# EAGLE design I2CLCD (EAGLE 7.1.0)
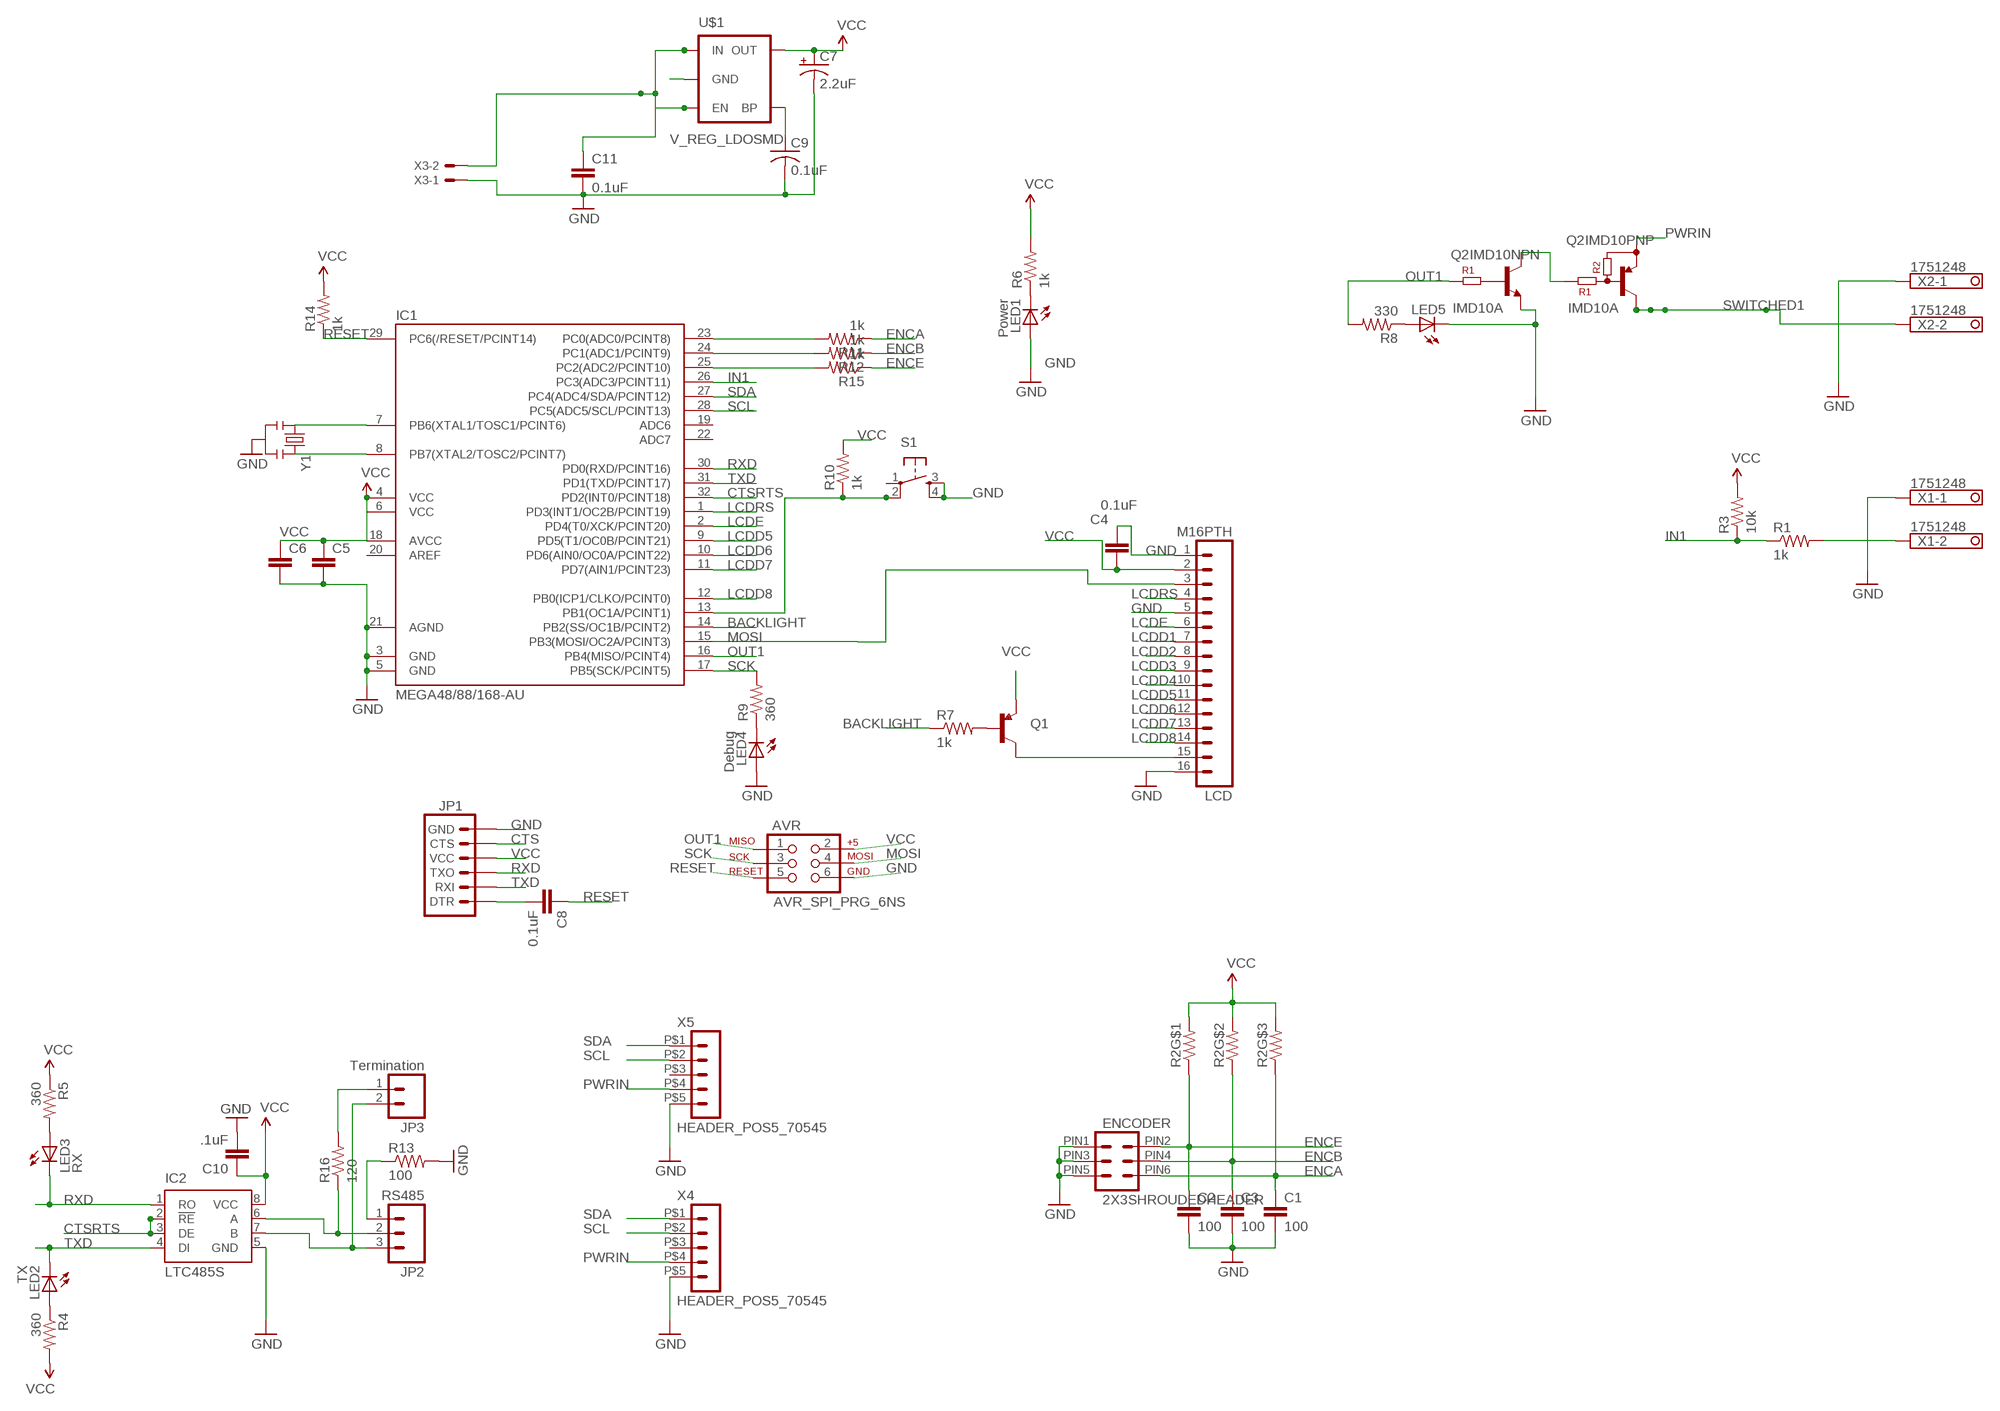
[diagram p0: schematic, sheet 1]

## Parts
AVR  AVR_SPI_PRG_6NS  [2X3-NS]
C1  100  CAP0603-CAP  [0603-CAP]
C2  100  CAP0603-CAP  [0603-CAP]
C3  100  CAP0603-CAP  [0603-CAP]
C4  0.1uF  CAP0603-CAP  [0603-CAP]
C5  CAP0603-CAP  [0603-CAP]
C6  CAP0603-CAP  [0603-CAP]
C7  2.2uF  CAP_POL1206  [EIA3216]
C8  0.1uF  CAP0603-CAP  [0603-CAP]
C9  0.1uF  C-USC0603  [C0603]
C10  .1uF  CAP0603-CAP  [0603-CAP]
C11  0.1uF  CAP0603-CAP  [0603-CAP]
ENCODER  2X3SHROUDEDHEADER  [2X3SHROUDEDHEADER]
IC1  MEGA48/88/168-AU  [TQFP32-08]
IC2  LTC485S  [SOIC8]
JP1  ARDUINO_SERIAL_PROGRAMPTH  [1X06]
JP2  RS485  M03SCREW_LOCK  [SCREWTERMINAL-3.5MM-3_LOCK.007S]
JP3  Termination  M02LOCK  [1X02_LOCK]
LCD  M16PTH  [1X16]
LED1  Power  LED0603  [LED-0603]
LED2  TX  LED0603  [LED-0603]
LED3  RX  LED0603  [LED-0603]
LED4  Debug  LED0603  [LED-0603]
LED5  LED0603  [LED-0603]
Q1  PNP  TRANSISTOR_PNPSMD  [SOT23-3]
Q2  IMD10A  [SC-74]
R1  1k  RESISTOR0603-RES  [0603-RES]
R2  RESISTOR_4PACK_US  [RESPACK_4X0603]
R3  10k  RESISTOR0603-RES  [0603-RES]
R4  360  R-US_R0603  [R0603]
R5  360  R-US_R0603  [R0603]
R6  1k  R-US_R0603  [R0603]
R7  1k  RESISTOR0603-RES  [0603-RES]
R8  330  RESISTOR0603-RES  [0603-RES]
R9  360  R-US_R0603  [R0603]
R10  1k  R-US_R0603  [R0603]
R11  1k  R-US_R0603  [R0603]
R12  1k  R-US_R0603  [R0603]
R13  100  RESISTOR  [0805]
R14  1k  R-US_R0603  [R0603]
R15  1k  R-US_R0603  [R0603]
R16  120  RESISTOR0603-RES  [0603-RES]
S1  TAC_SWITCHSMD  [TACTILE_SWITCH_SMD]
U$1  V_REG_LDOSMD  [SOT23-5]
X1  1751248  [1751248]
X2  1751248  [1751248]
X3  22-23-2021  [22-23-2021]
X4  HEADER_POS5_70545  [70545-POS5]
X5  HEADER_POS5_70545  [70545-POS5]
Y1  16Mhz  RESONATORSMD  [RESONATOR-SMD]

## Nets
A: IC2.6(A) JP2.2 R16.1
B: IC2.7(B) JP2.3 JP3.2
BACKLIGHT: IC1.14(PB2(SS/OC1B/PCINT2)) R7.1
CTS: JP1.5(CTS)
CTSRTS: IC1.32(PD2(INT0/PCINT18)) IC2.2(!RE) IC2.3(DE)
ENCA: C1.1 ENCODER.PIN6 R2.3 R11.1
ENCAF: IC1.23(PC0(ADC0/PCINT8)) R11.2
ENCB: C3.1 ENCODER.PIN4 R2.2 R12.1
ENCBF: IC1.24(PC1(ADC1/PCINT9)) R12.2
ENCE: C2.1 ENCODER.PIN2 R2.1 R15.1
ENCEF: IC1.25(PC2(ADC2/PCINT10)) R15.2
GND: AVR.6 C1.2 C2.2 C3.2 C4.2 C5.2 C6.2 C7.C(-) C9.2 C10.2 C11.2 ENCODER.PIN1 ENCODER.PIN3 ENCODER.PIN5 IC1.3(GND) IC1.5(GND) IC1.21(AGND) IC2.5(GND) JP1.6(GND) LCD.1 LCD.5 LCD.16 LED1.A LED4.A LED5.C Q2.3(IMD10NPN:E) R13.2 S1.3 S1.4 U$1.2(GND) X1.1 X2.1 X3.1 X4.P$5 X5.P$5 Y1.2
IN1: IC1.26(PC3(ADC3/PCINT11)) R1.1 R3.1
LCDD1: LCD.7
LCDD2: LCD.8
LCDD3: LCD.9
LCDD4: LCD.10
LCDD5: IC1.9(PD5(T1/OC0B/PCINT21)) LCD.11
LCDD6: IC1.10(PD6(AIN0/OC0A/PCINT22)) LCD.12
LCDD7: IC1.11(PD7(AIN1/PCINT23)) LCD.13
LCDD8: IC1.12(PB0(ICP1/CLKO/PCINT0)) LCD.14
LCDE: IC1.2(PD4(T0/XCK/PCINT20)) LCD.6
LCDRS: IC1.1(PD3(INT1/OC2B/PCINT19)) LCD.4
MOSI: AVR.4 IC1.15(PB3(MOSI/OC2A/PCINT3)) LCD.3
N$1: LCD.15 Q1.3(C)
N$3: IC1.8(PB7(XTAL2/TOSC2/PCINT7)) Y1.3
N$4: IC1.7(PB6(XTAL1/TOSC1/PCINT6)) Y1.1
N$5: C8.2 JP1.1(DTR)
N$6: R1.2 X1.2
N$7: IC1.13(PB1(OC1A/PCINT1)) R10.1 S1.2
N$8: LED4.C R9.1
N$10: JP3.1 R16.2
N$22: LED2.A R4.1
N$23: LED1.C R6.1
N$28: C9.1 U$1.4(BP)
N$36: Q1.1(B) R7.2
N$44: LED5.A R8.1
N$52: Q2.4(IMD10NPN:C) Q2.5(IMD10PNP:B)
N$91: JP2.1 R13.1
N$92: LED3.A R5.2
OUT1: AVR.1 IC1.16(PB4(MISO/PCINT4)) Q2.2(IMD10NPN:B) R8.2
PWRIN: C11.1 Q2.6(IMD10PNP:E) U$1.1(IN) U$1.3(EN) X3.2 X4.P$4 X5.P$4
RESET: AVR.5 C8.1 IC1.29(PC6(/RESET/PCINT14)) R14.1
RXD: IC1.30(PD0(RXD/PCINT16)) IC2.1(RO) JP1.3(TXO) LED3.C
SCK: AVR.3 IC1.17(PB5(SCK/PCINT5)) R9.2
SCL: IC1.28(PC5(ADC5/SCL/PCINT13)) X4.P$2 X5.P$2
SDA: IC1.27(PC4(ADC4/SDA/PCINT12)) X4.P$1 X5.P$1
SWITCHED1: Q2.1(IMD10PNP:C) X2.2
TXD: IC1.31(PD1(TXD/PCINT17)) IC2.4(DI) JP1.2(RXI) LED2.C
VCC: AVR.2 C4.1 C5.1 C6.1 C7.A(+) C10.1 IC1.4(VCC) IC1.18(AVCC) IC2.8(VCC) JP1.4(VCC) LCD.2 Q1.2(E) R2.6 R2.7 R2.8 R3.2 R4.2 R5.1 R6.2 R10.2 R14.2 U$1.5(OUT)
Unconnected: IC1.19(ADC6) IC1.20(AREF) IC1.22(ADC7) R2.4 R2.5 S1.1 X4.P$3 X5.P$3

## Power pins joined to a net without a drawn wire
VCC: IC1.6(VCC)

## Library data of the parts
AVR = SparkFun:AVR_SPI_PRG_6: AVR ISP 6 Pin This is the reduced ISP connector for AVR programming. Common on Arduino. This footprint will take up less PCB space and can be used with a 10-pin to 6-pin adapter such as SKU: BOB-08508
C1-C6 C8 C10 C11 = SparkFun:CAP: Capacitor Standard 0603 ceramic capacitor, and 0.1" leaded capacitor.
C7 = SparkFun:CAP_POL: Capacitor Polarized These are standard SMD and PTH capacitors. Normally 10uF, 47uF, and 100uF in electrolytic and tantalum varieties. Always verify the external diameter of the through hole cap, it varies with capacity, voltage, and manufacturer. The EIA devices should be standard.
C9 = rcl:C-US: CAPACITOR, American symbol
ENCODER = personal:2X3SHROUDEDHEADER
IC1 = avr-5:MEGA48/88/168
IC2 = linear-technology:LTC485: Low Power RS485 Interface Transceiver Source: http://www.linear.com/pc/downloadDocument.do?navId=H0,C1,C1007,C1017,P2064,D1718
JP1 = SparkFun:ARDUINO_SERIAL_PROGRAM
JP2 = SparkFun:M03: Header 3 Standard 3-pin 0.1" header. Use with straight break away headers (SKU : PRT-00116), right angle break away headers (PRT-00553), swiss pins (PRT-00743), machine pins (PRT-00117), and female headers (PRT-00115). Molex polarized connector foot print use with SKU : PRT-08232 with associated crimp pins and housings.
JP3 = SparkFun:M02: Header 2 Standard 2-pin 0.1" header. Use with straight break away headers (SKU : PRT-00116), right angle break away headers (PRT-00553), swiss pins (PRT-00743), machine pins (PRT-00117), and female headers (PRT-00115). Molex polarized connector foot print use with SKU : PRT-08233 with associated crimp pins and housings.
LCD = SparkFun:M16
LED1-LED5 = SparkFun:LED: LEDs Standard schematic elements and footprints for 5mm, 3mm, 1206, and 0603 sized LEDs. 5mm - Spark Fun Electronics SKU : COM-00529 (and others)
Q1 = SparkFun:TRANSISTOR_PNP
Q2 = personal:IMD10A
R1 R3 R7 R8 R13 R16 = SparkFun:RESISTOR: Resistor Basic schematic elements and footprints for 0603, 1206, and PTH 1/10th watt (small) resistors.
R2 = microbuilder:RESISTOR_4PACK_US: Resistor Packs (4 resistors) 4 x 0603 10K 1/16W - Digikey: YC164J-10KCT-ND
R4-R6 R9-R12 R14 R15 = rcl:R-US_: RESISTOR, American symbol
S1 = SparkFun:TAC_SWITCH: Momentary Switch Button commonly used for reset or general input. Spark Fun Electronics SKU : COM-00097
U$1 = SparkFun:V_REG_LDO: Voltage Regulator LDO Standard 150mA LDO voltage regulator in SOT-23 layout. Micrel part MIC5205. BP (by-pass) pin is used to lower output noise with 470pF cap.
X1 X2 = con-phoenix-350:1751248: MKDS 1/ 2-3,5 Printklemme Nennstrom: 10 A Bemessungsspannung: 160 V Raster: 3,5 mm Polzahl: 2 Montageart: Löten Anschlussart: Schraubanschluss Anschlussrichtung vom Leiter zur Platine: 0° Source: http://eshop.phoenixcontact.com .. 1751248.pdf
X3 = con-molex:22-23-2021: .100" (2.54mm) Center Header - 2 Pin
X4 X5 = con-molex-c-grid-sl:HEADER_POS5_?: Molex -C-Grid® / SL Series connector Wire-to-Board 2.54 mm (0.100") pitch header, 5 positions.
Y1 = SparkFun:RESONATOR: Resonator Small SMD resonator. This is the itty bitty 10/20MHz resonators with built in caps. CSTCE10M0G55 and CSTCE20M0V53. Footprint has been reviewed closely but hasn't been tested yet.

## Net classes
1 PWR: width 0.508 mm

## Board
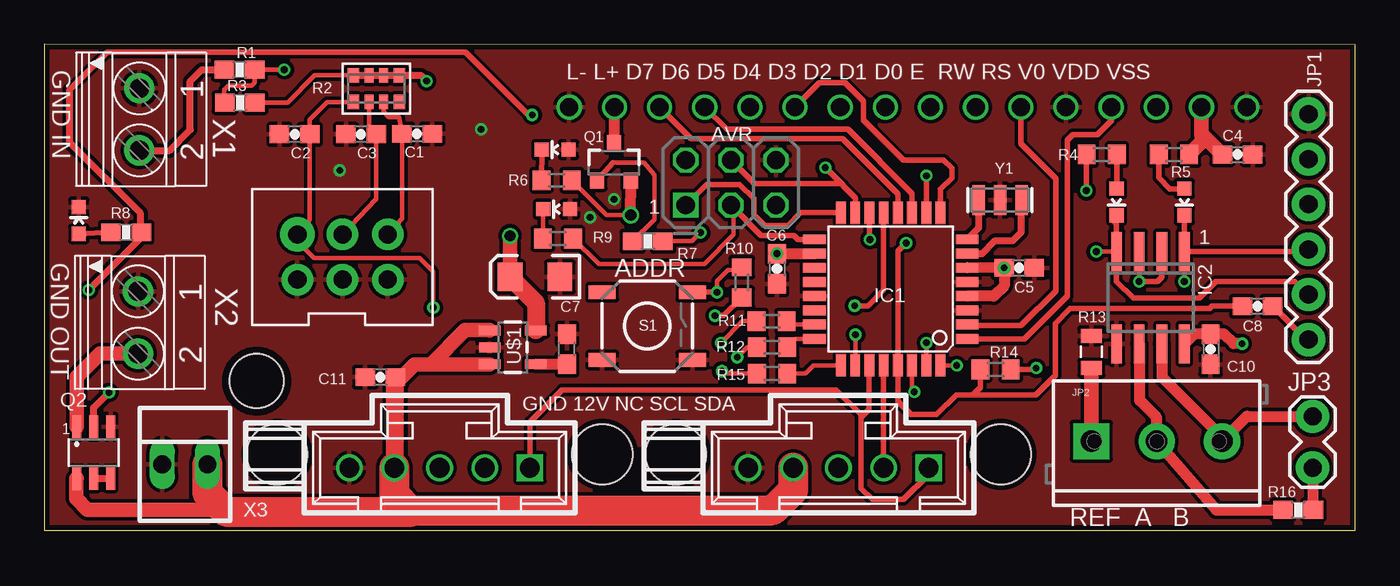
[diagram p1: board, top side]
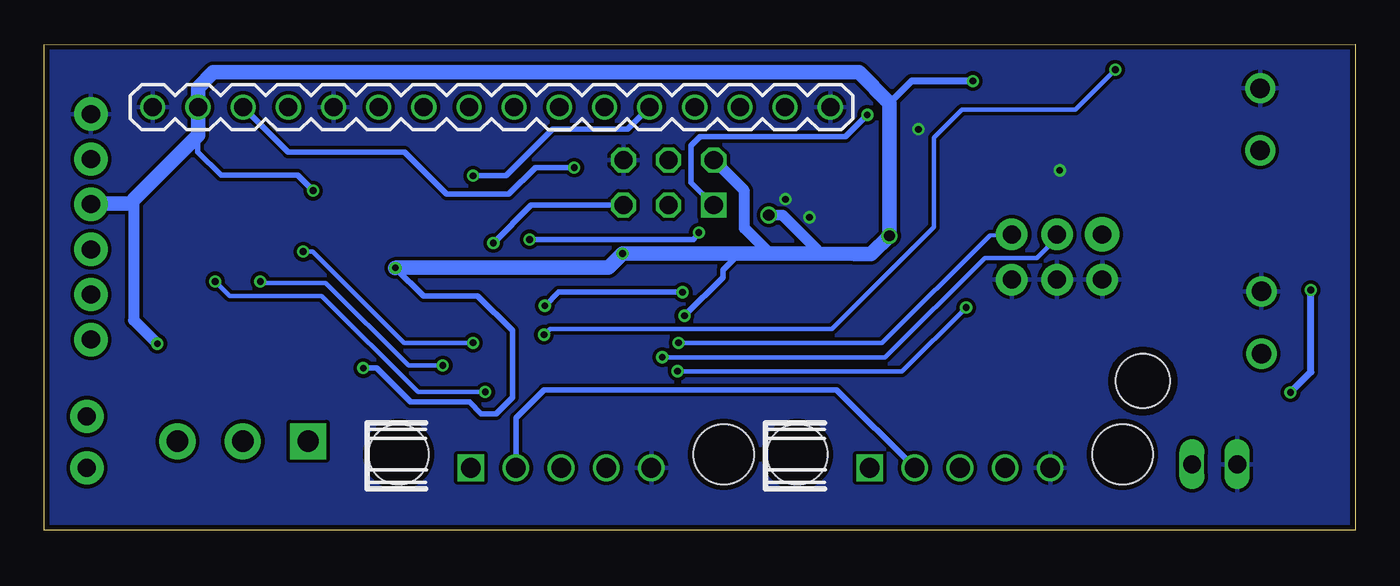
[diagram p2: board, bottom side, seen from below]

Size 73.71 x 27.33 mm. Coordinates in mm from the lower left corner, seen from the top.
Outline: 0,0 73.71,0 73.71,27.3 0,27.33 0,0
Copper layers (1*16): Top 0.035mm / dielectric 1.5mm / Bottom 0.035mm
Design rules "default *": minimum track width 8mil, minimum drill 15mil, track to track 8mil, track to pad 8mil, pad to pad 8mil, via to via 8mil, smd to smd 8mil, copper to edge 0.3mm, drill to drill 0.2mm, minimum pad ring 0.2mm, minimum via ring 0.15mm, stop-mask expansion 0.075mm, vias tented up to drill 15mil, thermal gap 0.2mm

### Footprints (pad centres in the part's own frame; a part is rotated, then mirrored left to right if it is on the bottom)
2X3-NS = drill 1.016 square: 1 -2.54,-1.27 | drill 1.016 octagon: 2 -2.54,1.27; 3 0,-1.27; 4 0,1.27; 5 2.54,-1.27; 6 2.54,1.27
0603-CAP = smd 1.1 x 1: 1 -0.85,0; 2 0.85,0
EIA3216 = smd 1.4 x 1.6: A 1.4,0; C -1.4,0
C0603 = smd 1.1 x 1: 1 -0.85,0; 2 0.85,0
2X3SHROUDEDHEADER = drill 1.02 pad 1.778: PIN1 0,2.54; PIN3 2.54,2.54; PIN4 2.54,5.08; PIN5 5.08,2.54; PIN6 5.08,5.08 | drill 1.02 pad 1.93: PIN2 0,5.08
TQFP32-08 = smd 1.27 x 0.559: 1 -4.293,2.8; 2 -4.293,2; 3 -4.293,1.2; 4 -4.293,0.4; 5 -4.293,-0.4; 6 -4.293,-1.2; 7 -4.293,-2; 8 -4.293,-2.8; 17 4.293,-2.8; 18 4.293,-2; 19 4.293,-1.2; 20 4.293,-0.4; 21 4.293,0.4; 22 4.293,1.2; 23 4.293,2; 24 4.293,2.8 | smd 0.559 x 1.27: 9 -2.8,-4.293; 10 -2,-4.293; 11 -1.2,-4.293; 12 -0.4,-4.293; 13 0.4,-4.293; 14 1.2,-4.293; 15 2,-4.293; 16 2.8,-4.293; 25 2.8,4.293; 26 2,4.293; 27 1.2,4.293; 28 0.4,4.293; 29 -0.4,4.293; 30 -1.2,4.293; 31 -2,4.293; 32 -2.8,4.293
SOIC8 = smd 0.6 x 2.2: 1 -1.905,-2.6; 2 -0.635,-2.6; 3 0.635,-2.6; 4 1.905,-2.6; 5 1.905,2.6; 6 0.635,2.6; 7 -0.635,2.6; 8 -1.905,2.6
1X06 = drill 1.016 pad 1.88: 1 0,0; 2 2.54,0; 3 5.08,0; 4 7.62,0; 5 10.16,0; 6 12.7,0
SCREWTERMINAL-3.5MM-3_LOCK.007S = drill 1.2 pad 2.032 square: 1 -0.178,0 | drill 1.2 pad 2.032: 2 3.5,0; 3 7.178,0
1X02_LOCK = drill 1.016 pad 1.88: 1 -0.178,0; 2 2.718,0
1X16 = drill 1.016: 1 0,0; 2 2.54,0; 3 5.08,0; 4 7.62,0; 5 10.16,0; 6 12.7,0; 7 15.24,0; 8 17.78,0; 9 20.32,0; 10 22.86,0; 11 25.4,0; 12 27.94,0; 13 30.48,0; 14 33.02,0; 15 35.56,0; 16 38.1,0
LED-0603 = smd 0.8 x 0.8: A 0,-0.75; C 0,0.75
SOT23-3 = smd 0.8 x 0.9: 1 -0.95,-1; 2 0.95,-1; 3 0,1.1
SC-74 = smd 0.5 x 1.3: 1 -0.95,1.45; 2 0,1.45; 3 0.95,1.45; 4 0.95,-1.45; 5 0,-1.45; 6 -0.95,-1.45
0603-RES = smd 1.1 x 1: 1 -0.85,0; 2 0.85,0
RESPACK_4X0603 = smd 0.65 x 0.8: 1 -1.3,-0.75; 4 1.3,-0.75; 5 1.3,0.75; 8 -1.3,0.75 | smd 0.5 x 0.8: 2 -0.4,-0.75; 3 0.4,-0.75; 6 0.4,0.75; 7 -0.4,0.75
R0603 = smd 1 x 1.1: 1 -0.85,0; 2 0.85,0
0805 = smd 0.8 x 1.2: 1 -0.9,0; 2 0.9,0
TACTILE_SWITCH_SMD = smd 1.524 x 0.762: 1 -2.54,1.905; 2 2.54,1.905; 3 -2.54,-1.905; 4 2.54,-1.905
SOT23-5 = smd 0.55 x 1.2: 1 -0.95,-1.3; 2 0,-1.3; 3 0.95,-1.3; 4 0.95,1.3; 5 -0.95,1.3
STAND-OFF-TIGHT = hole 3.048: 0,0
1751248 = drill 1.1 pad 1.7: 1 -1.75,-0.1; 2 1.75,-0.1
22-23-2021 = drill 1 long: 1 -1.27,0; 2 1.27,0
70545-POS5 = drill 1.1 square: P$1 5.08,0 | drill 1.1: P$2 2.54,0; P$3 0,0; P$4 -2.54,0; P$5 -5.08,0 | hole 3.404: -9.144,0.762; 9.144,0.762
RESONATOR-SMD = smd 0.7 x 1.7: 1 -1.2,0; 2 0,0; 3 1.2,0

### Placement (x,y rotation side)
AVR  38.61,19.56 0 top
C1  20.95,22.3 0 top
C2  14.07,22.28 180 top
C3  17.81,22.28 180 top
C4  67.11,21.13 0 top
C5  54.81,14.76 0 top
C6  41.2,14.71 270 top
C7  27.58,14.25 180 top
C8  68.22,12.6 0 top
C9  29.39,10.19 90 top
C10  65.58,10.19 270 top
C11  18.9,8.61 180 top
ENCODER  14.22,11.56 0 top
IC1  47.6,13.56 180 top
IC2  62.2,13.08 180 top
JP1  71.09,10.72 90 top
JP2  59.05,5 0 top
JP3  71.32,3.68 90 top
LCD  67.61,23.8 0 bottom
LED1  28.73,21.41 90 top
LED2  60.3,18.47 180 top
LED3  64.11,18.47 180 top
LED4  28.8,18.06 90 top
LED5  1.93,17.42 0 top
Q1  32.03,20.68 0 top
Q2  2.77,4.37 0 top
R1  10.97,25.91 180 top
R2  18.67,24.84 0 top
R3  11,24.05 0 top
R4  59.46,21.13 180 top
R5  63.53,21.13 180 top
R6  28.8,19.69 0 top
R7  33.93,16.26 180 top
R8  4.6,16.76 0 top
R9  28.88,16.41 0 top
R10  39.22,13.94 270 top
R11  40.89,11.76 0 top
R12  40.92,10.29 0 top
R13  58.88,10.03 90 top
R14  53.49,9.04 0 top
R15  40.92,8.81 0 top
R16  70.51,1.14 0 top
S1  33.91,11.48 0 top
U$1  26.34,10.29 270 top
U$2  [STAND-OFF-TIGHT]  11.94,8.38 0 top
X1  5.44,23.11 270 top
X2  5.36,11.68 270 top
X3  7.9,3.71 0 top
X4  22.22,3.51 0 top
X5  44.65,3.51 0 top
Y1  53.75,18.57 180 top

### Tracks (layer width: path | path; a pad name or v marks a point on that pad's centre or on a via)
A
  Top 0.61: IC2.6 61.59,10.46 61.59,7.29 62.55,6.33 JP2.2 65.91,1.14 R16.1
B
  Top 0.61: IC2.7 62.86,10.46 62.86,8.59 66.23,5.22 JP2.3 67.63,6.4 JP3.2
BACKLIGHT  (via drill 0.38)
  Top 0.254: v36.91,16.74 36.42,16.26 R7.1
  Top 0.305: IC1.14 46.4,16.39 v46.43,16.36
  Bottom 0.305: v46.43,16.36 37.21,16.36 v36.91,16.74
CTSRTS  (via drill 0.38)
  Top 0.254: IC1.32 v51.31,9.27 | v61.57,14 IC2.3
  Top 0.305: IC2.2 62.84,14.25 62.59,14 v61.57,14
  Bottom 0.254: v51.31,9.27 53.24,9.27 57.89,13.92 61.49,13.92 v61.57,14
ENCA  (via drill 0.38)
  Top 0.254: R2.3 19.07,23.55 19.35,23.24 19.95,23.24 C1.1 20.1,17.54 ENCODER.PIN6 | v38.05,10.54 39.27,11.76 R11.1
  Bottom 0.254: 37.95,10.52 v38.05,10.54 26.75,10.52 26.62,10.52 20.55,16.59 ENCODER.PIN6
ENCAF
  Top 0.254: R11.2 41.94,11.56 IC1.23
ENCB  (via drill 0.38)
  Top 0.254: R2.2 18.27,22.66 C3.1 18.66,18.6 18.63,18.6 ENCODER.PIN4 | v38.96,9.73 39.52,10.29 R12.1
  Bottom 0.254: v38.96,9.73 27.31,9.71 26.44,9.71 20.83,15.32 17.91,15.32 16.64,16.59 ENCODER.PIN4
ENCBF
  Top 0.254: R12.2 42.25,10.76 IC1.24
ENCE  (via drill 0.38)
  Top 0.254: R2.1 15.9,24.08 14.92,23.1 C2.1 14.92,17.44 ENCODER.PIN2 14.07,16.41 15.16,15.32 21.11,15.32 21.87,14.55 v21.87,12.52 | v38.1,8.94 38.23,8.81 R15.1
  Bottom 0.254: v38.1,8.94 26.9,8.92 25.47,8.92 v21.87,12.52
ENCEF
  Top 0.254: R15.2 42.8,8.81 43.26,9.27 IC1.25
GND  (via drill 0.38)
  other vias: 16.61,20.24 24.56,22.56 30.68,17.6 32.03,18.62
  pour Bottom: 73.38,27.23 -0.2,27.2 0.13,-0.23 73.51,0.05
  pour Top: 0.05,-0.15 73.56,-0.03 73.36,27.23 17.12,27.28 -0.1,27.1
IN1  (via drill 0.38)
  Top 0.254: IC1.26 45.62,9.29 v45.62,11 | v13.49,25.91 R1.1 11.82,25.18 11.66,25.02 10.34,25.02 10.11,24.79 10.11,24.17 R3.1
  Bottom 0.254: v45.62,11 45.29,11.33 29.41,11.33 23.7,17.04 23.7,22.07 22.1,23.67 15.72,23.67 v13.49,25.91
LCDD5
  Top 0.305: LCD.11 43.59,25.17 45.03,25.17 46.08,24.13 46.08,23.06 48.31,20.83 50.57,20.83 51.03,20.37 51.03,19.81 50.4,19.18 IC1.9
LCDD6  (via drill 0.38)
  Top 0.305: v49.61,19.94 v49.6,19.93 IC1.10
  Bottom 0.305: LCD.12 40.92,22.56 45.14,22.56 47.75,19.94 v49.61,19.94
LCDD7
  Top 0.305: LCD.13 38.38,22.56 45.19,22.56 48.8,18.94 IC1.11
LCDD8
  Top 0.305: LCD.14 36.37,22.02 44.88,22.02 48,18.9 IC1.12
LCDE
  Top 0.305: IC1.2 51.95,11.51 54.91,11.51 56.87,13.46 56.87,19.79 54.91,21.74 LCD.6
LCDRS
  Top 0.305: IC1.1 55.12,10.77 57.53,13.18 57.53,21.95 57.84,22.25 59.21,22.25 59.99,23.04 LCD.4
MOSI  (via drill 0.38)
  Top 0.305: AVR.4 39.93,19.51 44.78,19.51 44.91,19.38 | 44.91,19.38 45.6,18.69 IC1.15 | v43.92,20.4 44.91,19.41 44.91,19.38
  Bottom 0.305: LCD.3 59.99,21.26 53.47,21.26 51.1,18.9 47.6,18.9 46.1,20.4 v43.92,20.4
N$1
  Top 0.61: Q1.3 32.05,21.65 LCD.15
N$3
  Top 0.406: Y1.3 52.55,17.02 IC1.8
N$4
  Top 0.406: Y1.1 54.94,16.76 54.46,16.28 53.47,16.28 52.75,15.56 IC1.7
N$5
  Top 0.305: C8.2 70.95,10.72 JP1.1
N$6
  Top 0.406: R1.2 8.84,25.91 8.2,25.27 8.2,22.53 7.04,21.36 X1.2
N$7  (via drill 0.38)
  Top 0.254: R10.1 39,14.63 38.43,14.63 37.82,14.02 v37.82,13.39
  Top 0.305: IC1.13 47.19,13.51 46.3,12.62 v45.57,12.62 | S1.2 v37.82,13.39
  Bottom 0.305: v45.57,12.62 44.81,13.39 v37.82,13.39
N$8
  Top 0.254: LED4.C R9.1
N$10
  Top 0.61: JP3.1 71.36,2.83 R16.2
N$22
  Top 0.305: R4.1 LED2.A
N$23
  Top 0.305: R6.1 LED1.C
N$28
  Top 0.61: U$1.4 27.71,9.34 C9.1
N$36
  Top 0.254: R7.2 34.32,17.49 34.32,19.99 33.73,20.68 31.98,20.68
  Top 0.305: 31.98,20.68 Q1.1
N$44
  Top 0.305: R8.1 3.74,16.78 LED5.A
N$52
  Top 0.406: Q2.5 Q2.4
N$91
  Top 0.813: JP2.1 R13.1
N$92
  Top 0.305: R5.2 62.68,19.82 63.3,19.2 64.1,19.2 LED3.A
OUT1  (via drill 0.38)
  Top 0.305: AVR.1 37.24,19.46 39.09,19.46 39.9,18.64 39.9,17.73 40.49,17.14 41.81,17.14 42.52,17.86 IC1.16 | 1.42,24.79 3.53,26.9 23.67,26.9 27.2,23.37 v27.43,23.37
  Top 0.406: v2.49,13.51 5.45,16.47 R8.2 5.41,16.8 5.41,17.83 1.42,21.82 1.42,24.79 | Q2.2 2.77,6.88 v3.63,7.75
  Bottom 0.305: AVR.1 37.34,19.56 37.34,21.64 36.83,22.15 28.65,22.15 v27.43,23.37
  Bottom 0.406: v3.63,7.75 2.49,8.89 v2.49,13.51
PWRIN
  Top 0.254: C11.1 19.71,8.57 19.71,7.77
  Top 0.61: U$1.1 24.59,11.24 | 10.29,1.04 10.03,1.3
  Top 0.813: 19.71,8.23 20.82,9.34 21.73,9.34 | 21.73,9.34 U$1.3 | U$1.1 25.02,11.25 23.65,11.25 21.73,9.34 | 10.1,1.16 2.4,1.16 1.78,1.78 1.78,2.88 Q2.6
  Top 1.016: X4.P$4 19.71,3.53 19.71,7.77 19.71,8.23
  Top 1.676: X4.P$4 19.68,1.98 20.55,1.12 20.73,1.12 | 20.73,1.12 40.97,1.12 42.11,2.26 X5.P$4 | X3.2 9.17,2.08 10.1,1.16 10.21,1.04 10.29,1.04 20.65,1.04 20.73,1.12
RESET  (via drill 0.38)
  Top 0.305: v48.46,16.15 48,15.69 IC1.29 48,7.25 48.74,6.5 50.16,6.5 51.28,7.62 52.22,7.62 | 52.81,8.88 R14.1 52.64,8.04 52.22,7.62 | C8.1 65.66,12.6 65.53,12.47 57.68,12.47 56.85,11.63 56.85,8.71 55.75,7.62 52.22,7.62
  Bottom 0.305: AVR.5 46.33,18.29 v48.46,16.15
RXD  (via drill 0.38)
  Top 0.254: IC1.30 48.8,7.89 v48.92,7.77 | v64.11,14 IC2.1
  Top 0.305: JP1.3 71.15,15.68 IC2.1 LED3.C
  Bottom 0.254: v48.92,7.77 52.7,7.77 58.12,13.18 63.3,13.18 v64.11,14
SCK
  Top 0.254: AVR.3 38.76,18.14 38.76,16.64 37.11,14.99 31.2,14.99 R9.2
  Top 0.305: AVR.3 40.31,16.59 42.16,16.59 42.39,16.36 IC1.17
SCL
  Top 0.305: IC1.28 X5.P$2
  Bottom 0.305: X4.P$2 29.16,7.9 45.62,7.9 47.19,6.32 X5.P$2
SDA
  Top 0.305: IC1.27 46.38,9.27 46.38,6.81 45.92,6.35 | 45.92,6.35 45.92,2.36 46.56,1.73 48.31,1.73 49.73,3.15 X5.P$1 | X4.P$1 27.3,6.1 29.11,7.9 44.53,7.9 45.92,6.5 45.92,6.35
SWITCHED1
  Top 0.813: Q2.1 1.82,8.63 3.12,9.93 X2.2
TXD  (via drill 0.38)
  Top 0.254: IC1.31 v49.6,10.53 v49.61,10.54 | v59.16,15.67 IC2.4
  Top 0.305: JP1.2 71.07,13.26 70.33,14 65.89,14 64.95,13.06 61.24,13.06 60.3,14 IC2.4 60.3,17.25 60.17,17.37 60.17,17.59 LED2.C
  Bottom 0.254: v49.61,10.54 53.49,10.54 58.62,15.67 v59.16,15.67
VCC  (via drill 0.38, 0.6, 0.64)
  Top 0.254: R3.2 13.67,24.05 15.19,25.6 17.36,25.6 R2.8 | R6.2 31.61,17.73 v32.97,17.73
  Top 0.305: R14.2 55.7,9.04 v55.78,9.12 | R4.2 58.6,21.12 v58.6,19.1 | R10.2 38.19,12.06 v37.72,12.06
  Top 0.406: R2.8 R2.7 R2.6 21.17,25.59 v21.49,25.27
  Top 0.61: IC2.8 64.66,11.04 C10.1 65.6,11.05 66.32,11.05 66.88,10.49 v67.36,10.49 | 41.21,15.56 IC1.18 | IC1.6 C5.1 | C5.1 53.91,14.73 v53.97,14.76 | C5.1 53.97,14.75 53.97,13.74 53.4,13.16 IC1.4 | v32.97,17.73 Q1.2
  Top 0.813: C6.1 41.21,15.56 | 65.05,23.83 LCD.2 65.07,22.31 | 65.07,22.31 C4.1 | R5.1 65.24,22 65.3,22 65.07,22.22 65.07,22.31 | C7.A v26.19,16.56
  Top 1.016: U$1.5 27.64,12.79 C7.A
  Bottom 0.305: 33.83,15.56 34.63,15.56 35.56,14.63 35.56,14.22 v37.72,12.06 | v55.78,9.12 55.02,9.12 53.11,7.21 49.81,7.21 49.15,6.55 48.31,6.55 47.4,7.47 47.4,11.23 49.35,13.18 52.4,13.18 v53.97,14.76 | v58.6,19.1 59.46,19.96 63.78,19.96 65.09,21.28 65.09,21.85 65.07,21.87 65.07,22.4
  Bottom 0.406: v21.49,25.27 24.94,25.27 26.19,24.03
  Bottom 0.61: AVR.2 34.34,19.1 34.34,16.99 32.9,15.56 31.72,15.56 | 30.28,15.56 30.28,15.8 32.18,17.7 v32.97,17.73 | v67.36,10.49 68.69,11.82 68.69,18.61
  Bottom 0.813: v53.97,14.76 53.91,14.77 41.99,14.77 C6.1 33.83,15.56 31.72,15.56 30.28,15.56 28.16,15.53 27.22,15.53 v26.19,16.56 26.19,24.03 27.91,25.76 64.21,25.76 65.07,24.89 LCD.2 65.07,22.4 65.07,22.22 68.69,18.61 68.94,18.36 71.25,18.36 JP1.4
  other vias: 41.2,15.56

### Text on the board
tNames: GND IN | L- L+ D7 D6 D5 D4 D3 D2 D1 D0 E RW RS V0 VDD VSS | 1 | 1 | GND OUT | ADDR | GND 12V NC SCL SDA | REF A B
tValues: Output | DTR RX TX VCC CTS GND